# Altium project E4_TP2_Flyback.PrjPcb
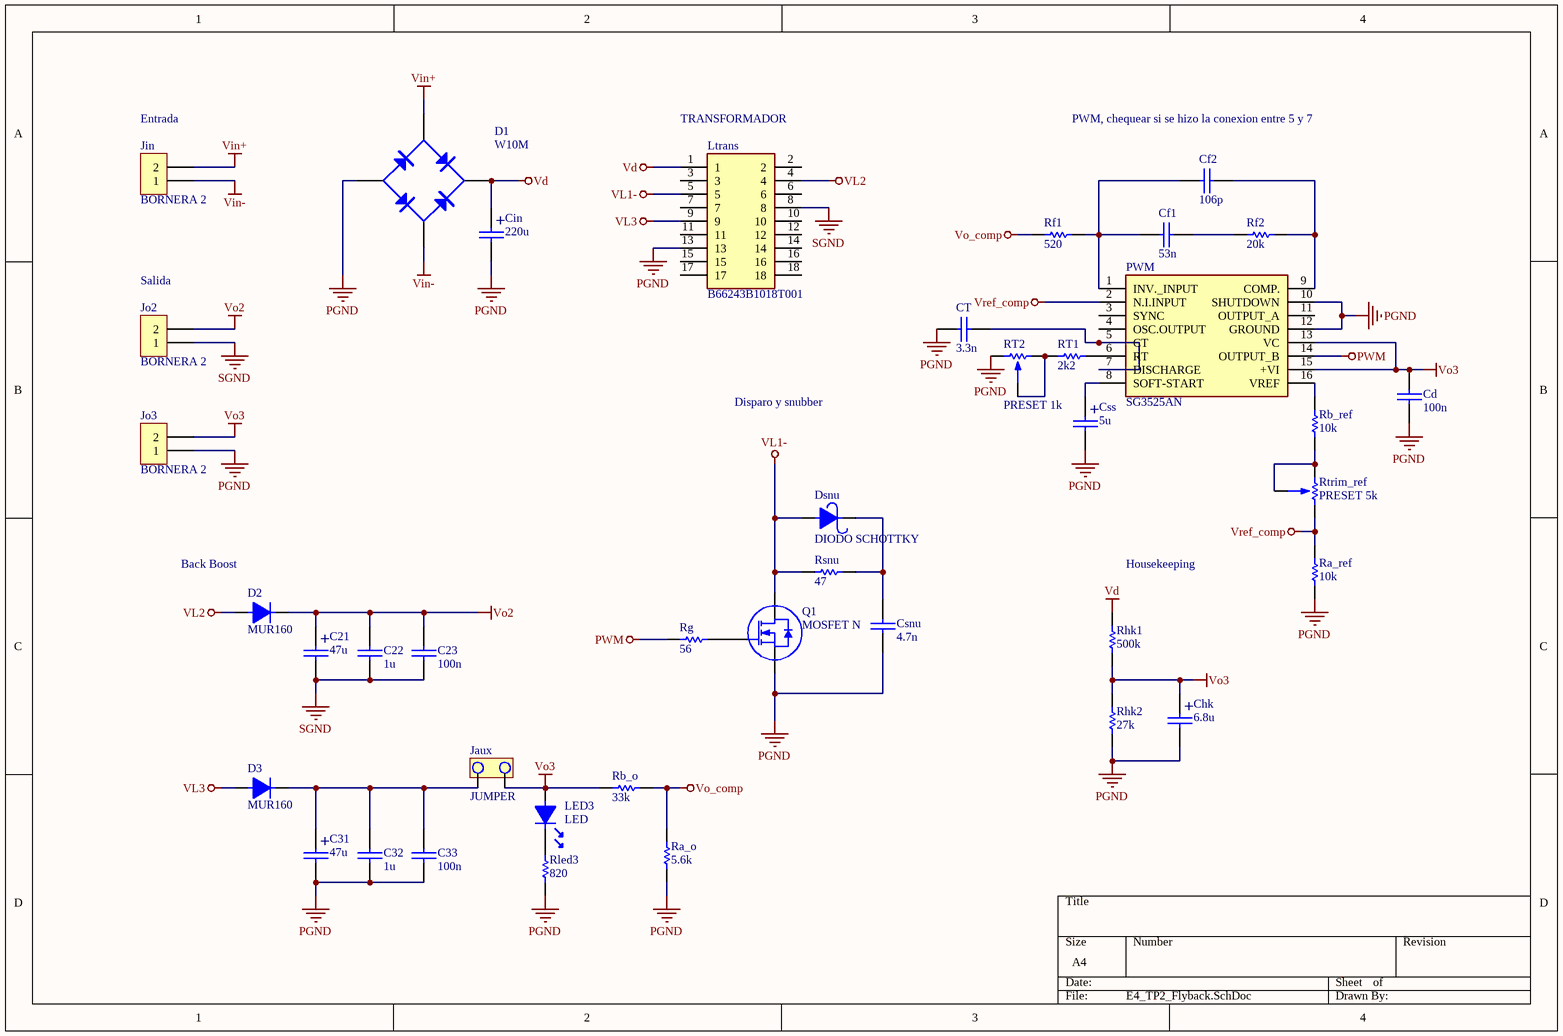
[diagram p0: E4_TP2_Flyback.SchDoc]
1 sheet, 40 parts. Net scope: global (net labels, ports and power ports of the same name join across sheets).
Board file: E4_TP2_Flyback.PcbDoc

## Sheet E4_TP2_Flyback.SchDoc
size A4; SheetNumber: 1; SheetTotal: 1

### Parts
C21  47u  [CAP200RP]
C22  1u  [CAP200]
C23  100n  [CAP100]
C31  47u  [CAP200RP]
C32  1u  [CAP200]
C33  100n  [CAP100]
Cd  100n  [CAP100]
Cf1  53n  [CAP100]
Cf2  106p  [CAP100]
Chk  6.8u  [CAP100RP]
Cin  220u  [CAP200RP2]
Csnu  4.7n  [CAP200]
Css  5u  [CAP100RP]
CT  3.3n  [CAP100]
D1  W10M  [PUENTE - W10M]
D2  MUR160  [DO41]
D3  MUR160  [DO41]
Dsnu  DIODO SCHOTTKY  [DO41]
Jaux  JUMPER  [JUMPER2]
Jin  BORNERA 2  [BORNERA2]
Jo2  BORNERA 2  [BORNERA2]
Jo3  BORNERA 2  [BORNERA2]
LED3  LED  [LED3]
Ltrans  B66243B1018T001  [B66243B1018T001]
PWM  SG3525AN  [DIP850W50P254L2000H510Q16N]
Q1  MOSFET N  [TO-220 V]
Ra_o  5.6k  [RES400]
Ra_ref  10k  [RES400]
Rb_o  33k  [RES400]
Rb_ref  10k  [RES400]
Rf1  520  [RES400]
Rf2  20k  [RES400]
Rg  56  [RES600]
Rhk1  500k  [RES400]
Rhk2  27k  [RES400]
Rled3  820  [RES400]
Rsnu  47  [RES600]
RT1  2k2  [RES400]
RT2  PRESET 1k  [PRESET V]
Rtrim_ref  PRESET 5k  [PRESET V]

### Nets
PGND: C31.2 C32.2 C33.2 Cd.2 Chk.2 Cin.2 Csnu.2 Css.2 CT.2 D1.3(V-) Jo3.1 Ltrans.13 PWM.10(SHUTDOWN) PWM.12(GROUND) Q1.3(S) Ra_o.2 Ra_ref.2 Rhk2.2 Rled3.2 RT2.3
PWM: PWM.14(OUTPUT_B) Rg.1
SGND: C21.2 C22.2 C23.2 Jo2.1 Ltrans.8
Vd: Cin.1 D1.1(V+) Ltrans.1 Rhk1.1
Vin+: D1.2(AC) Jin.2
Vin-: D1.4(AC) Jin.1
VL1-: Dsnu.1 Ltrans.5 Q1.2(D) Rsnu.1
VL2: D2.1 Ltrans.4
VL3: D3.1 Ltrans.9
Vo2: C21.1 C22.1 C23.1 D2.2 Jo2.2
Vo3: Cd.1 Chk.1 Jaux.1 Jo3.2 LED3.1 PWM.13(VC) PWM.15(+VI) Rb_o.2 Rhk1.2 Rhk2.1
Vo_comp: Ra_o.1 Rb_o.1 Rf1.1
Vref_comp: PWM.2(N.I.INPUT) Ra_ref.1 Rtrim_ref.1
NetC31_1: C31.1 C32.1 C33.1 D3.2 Jaux.2
NetCf1_1: Cf1.1 Rf2.1
NetCf1_2: Cf1.2 Cf2.2 PWM.1(INV._INPUT) Rf1.2
NetCf2_1: Cf2.1 PWM.9(COMP.) Rf2.2
NetCsnu_1: Csnu.1 Dsnu.2 Rsnu.2
NetCss_1: Css.1 PWM.8(SOFT-START)
NetCT_1: CT.1 PWM.5(CT) PWM.7(DISCHARGE)
NetLED3_2: LED3.2 Rled3.1
NetPWM_6: PWM.6(RT) RT1.2
NetPWM_16: PWM.16(VREF) Rb_ref.1
NetQ1_1: Q1.1(G) Rg.2
NetRb_ref_2: Rb_ref.2 Rtrim_ref.2 Rtrim_ref.3
NetRT1_1: RT1.1 RT2.1 RT2.2

Not connected (* = marked no-connect by the designer): Ltrans 2 3 6 7 10 11 12 14 15 16 17 18; PWM 3(SYNC) 4(OSC.OUTPUT) 11(OUTPUT_A)

### Notes on the sheet
- (near Jin) Entrada
- (near Ltrans) TRANSFORMADOR
- PWM, chequear si se hizo la conexion entre 5 y 7
- (near Jo2) Salida
- Disparo y snubber
- (near D2) Back Boost
- Housekeeping
- (in symbol CAPPOL) +

### Library data of the parts
C21 C31 Chk Cin Css = CAPPOL
C22 C23 C32 C33 Cd Cf1 Cf2 Csnu CT = CAP
D1 = PUENTE
D2 D3 = DIODO
Ltrans = B66243B1018T001: Inductor; Manufacturer_Name: TDK; Datasheet Link: https://product.tdk.com/system/files/dam/doc/product/ferrite/ferrite/ferrite-acc/data_sheet/80/db/fer/e_42_21_20.pdf; Height: 51mm; Manufacturer_Part_Number: B66243B1018T001; Mouser Part Number: N/A; Mouser Price/Stock: https://www.mouser.co.uk/ProductDetail/EPCOS-TDK/B66243B1018T001?qs=W0yvOO0ixfHL1dNOx1DZxg%3D%3D; Arrow Part Number: B66243B1018T001; Arrow Price/Stock: https://www.arrow.com/en/products/b66243b1018t001/epcos-tdk
PWM = SG3525AN: Integrated Circuit; Manufacturer_Name: STMicroelectronics; Datasheet Link: http://componentsearchengine.com/Datasheets/3/SG3525AN.pdf; Height: 5.1mm; Manufacturer_Part_Number: SG3525AN; Mouser Part Number: 511-SG3525AN; Mouser Price/Stock: https://www.mouser.co.uk/ProductDetail/STMicroelectronics/SG3525AN?qs=lgHKUCmDFthRkkwDjx3E7g%3D%3D; Arrow Part Number: SG3525AN; Arrow Price/Stock: https://www.arrow.com/en/products/sg3525an/stmicroelectronics?region=nac
Ra_o Ra_ref Rb_o Rb_ref Rf1 Rf2 Rg Rhk1 Rhk2 Rled3 Rsnu RT1 = RES
RT2 Rtrim_ref = PRESET